# EAGLE schematic RS485 RX (EAGLE 9.6.2)
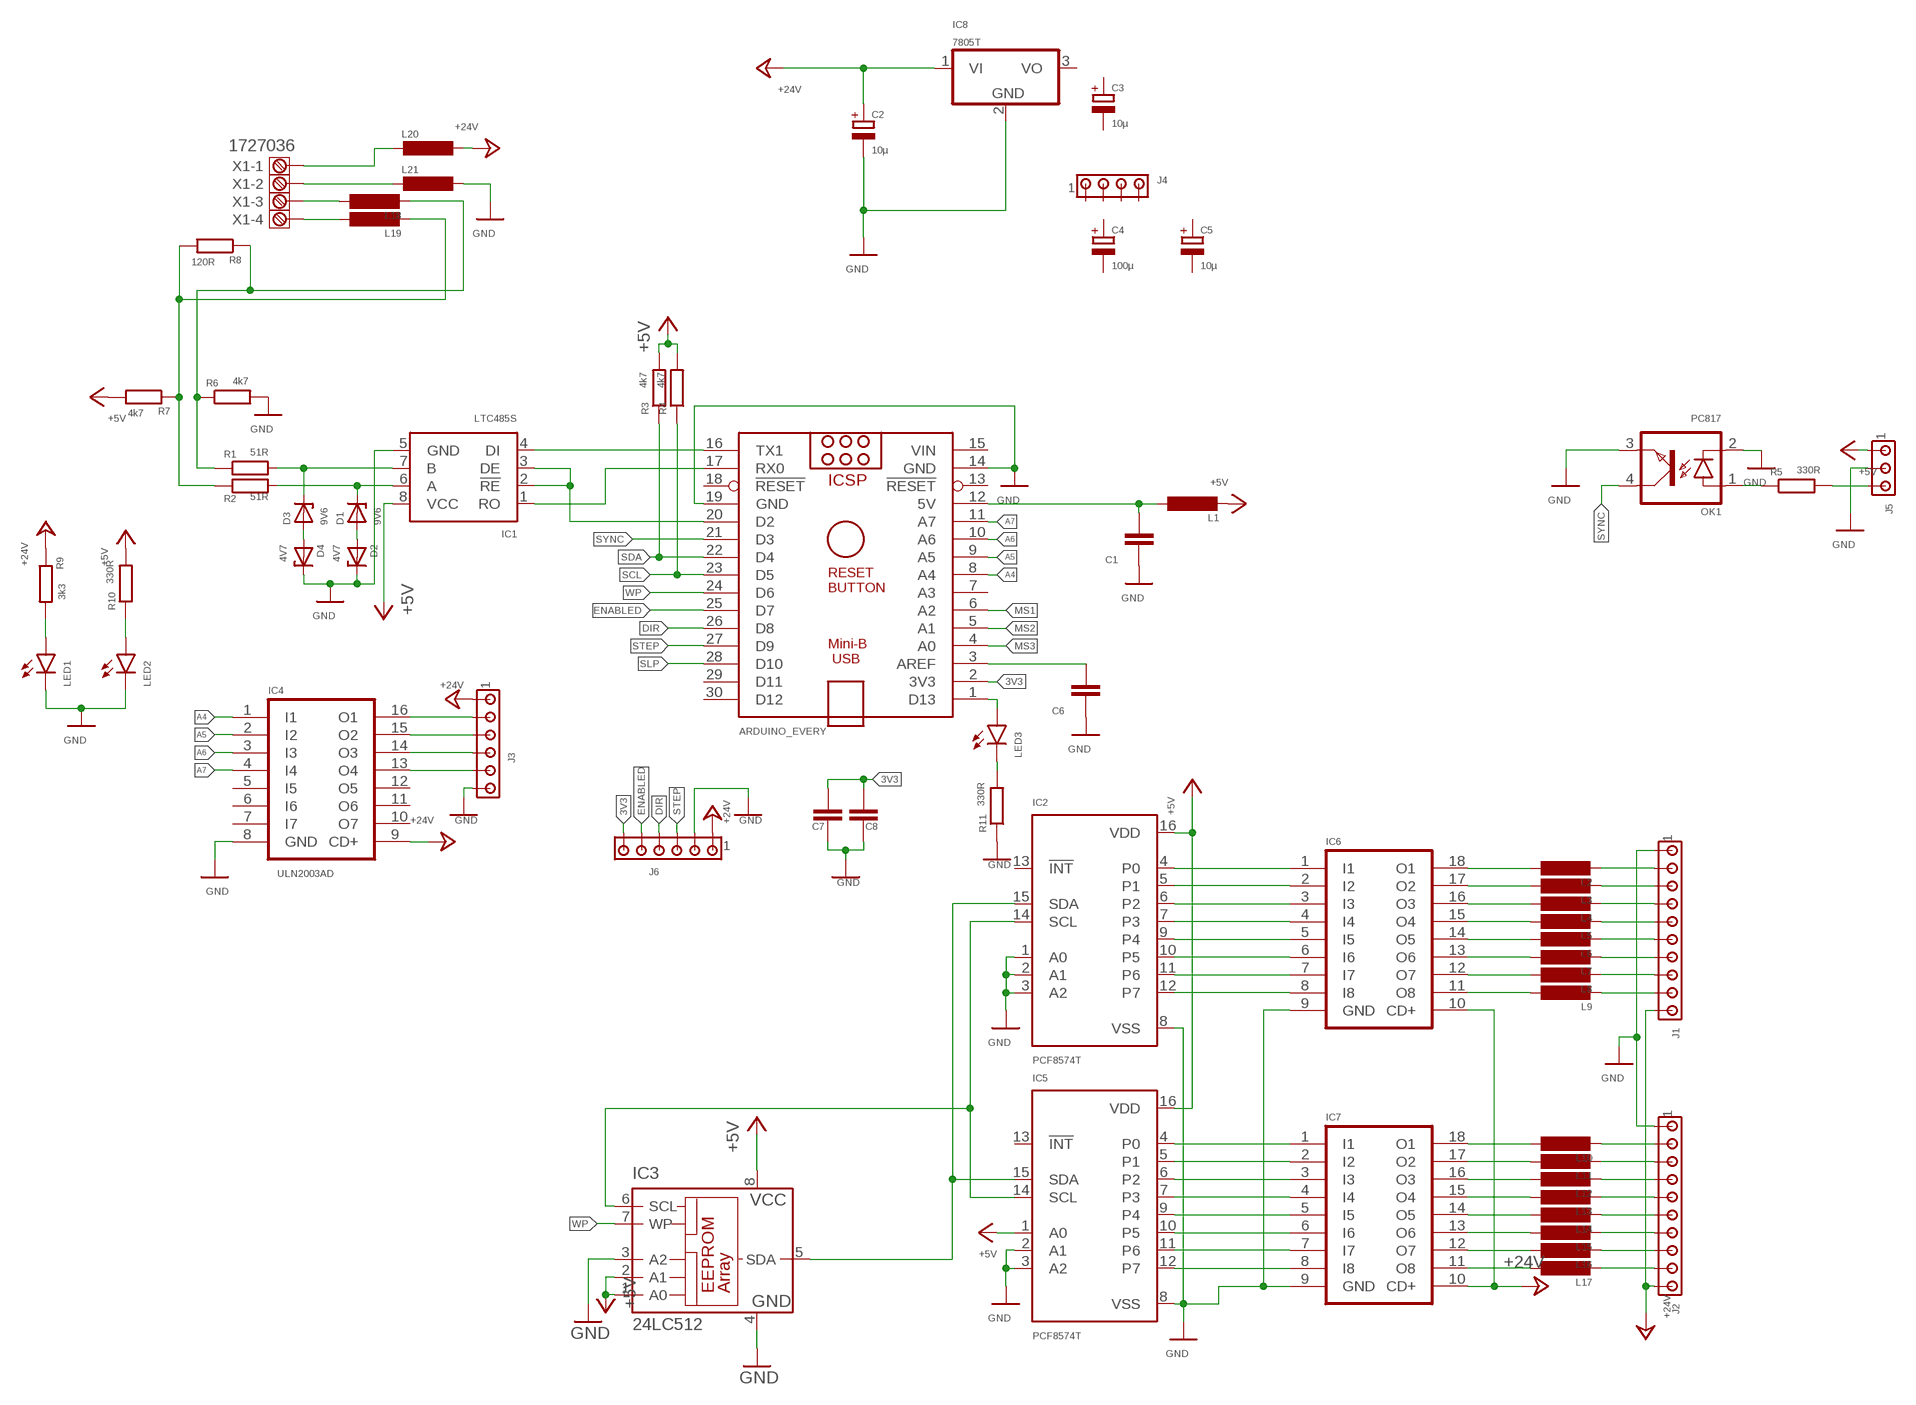
[diagram p0: schematic, sheet 1]

## Parts
ARDUINO_EVERY  ARDUINO_NANO  [ARDUINO_NANO]
C1  C-EUC0805K  [C0805K]
C2  10µ  CPOL-EU150CLZ-0810  [150CLZ-0810]
C3  10µ  CPOL-EU150CLZ-0810  [150CLZ-0810]
C4  100µ  CPOL-EU150CLZ-0810  [150CLZ-0810]
C5  10µ  CPOL-EU150CLZ-0810  [150CLZ-0810]
C6  C-EUC0805K  [C0805K]
C7  C-EUC0805K  [C0805K]
C8  C-EUC0805K  [C0805K]
D1  9V6  ZENER-DIODESOD80C  [SOD80C]
D2  4V7  ZENER-DIODESOD80C  [SOD80C]
D3  9V6  ZENER-DIODESOD80C  [SOD80C]
D4  4V7  ZENER-DIODESOD80C  [SOD80C]
IC1  LTC485S  [SOIC8]
IC2  PCF8574T  [SO16W]
IC3  24LC512  24LC128SN  [SO-08]
IC4  ULN2003AD  [SO16]
IC5  PCF8574T  [SO16W]
IC6  ULN2803A  [DIL18]
IC7  ULN2803A  [DIL18]
IC8  7805T  [TO220H]
J1  MTA10-100  [10X10MTA]
J2  MTA10-100  [10X10MTA]
J3  MTA06-100  [10X06MTA]
J4  MTA04-156  [1X4MTA]
J5  MTA03-100  [10X03MTA]
J6  MTA06-100  [10X06MTA]
L1  L-EUL1812  [L1812]
L2  L-EUL1812  [L1812]
L3  L-EUL1812  [L1812]
L4  L-EUL1812  [L1812]
L5  L-EUL1812  [L1812]
L6  L-EUL1812  [L1812]
L7  L-EUL1812  [L1812]
L8  L-EUL1812  [L1812]
L9  L-EUL1812  [L1812]
L10  L-EUL1812  [L1812]
L11  L-EUL1812  [L1812]
L12  L-EUL1812  [L1812]
L13  L-EUL1812  [L1812]
L14  L-EUL1812  [L1812]
L15  L-EUL1812  [L1812]
L16  L-EUL1812  [L1812]
L17  L-EUL1812  [L1812]
L18  L-EUL1812  [L1812]
L19  L-EUL1812  [L1812]
L20  DO3316P  [DO3316P]
L21  DO3316P  [DO3316P]
LED1  LEDCHIPLED_1206  [CHIPLED_1206]
LED2  LEDCHIPLED_1206  [CHIPLED_1206]
LED3  LEDCHIPLED_1206  [CHIPLED_1206]
OK1  PC817  [DIL04]
R1  51R  R-EU_R0805  [R0805]
R2  51R  R-EU_R0805  [R0805]
R3  4k7  R-EU_R0805  [R0805]
R4  4k7  R-EU_R0805  [R0805]
R5  330R  R-EU_R0805  [R0805]
R6  4k7  R-EU_R0805  [R0805]
R7  4k7  R-EU_R0805  [R0805]
R8  120R  R-EU_R0805  [R0805]
R9  3k3  R-EU_R0805  [R0805]
R10  330R  R-EU_R0805  [R0805]
R11  330R  R-EU_R0805  [R0805]
X1  1727036  [1727036]

## Nets
3V3: ARDUINO_EVERY.2(3V3) C7.1 C8.1 J6.6
+5V: IC1.8(VCC) IC2.16(VDD) IC3.1(A0) IC3.2(A1) IC3.8(VCC) IC5.1(A0) IC5.16(VDD) J5.1 L1.2 R3.2 R4.2 R7.2 R10.2
+24V: C2.+ IC4.9(CD+) IC6.10(CD+) IC7.10(CD+) IC8.1(VI) J1.10 J2.10 J3.1 J6.1 L20.2 R9.1
A4: ARDUINO_EVERY.8(A4) IC4.1(I1)
A5: ARDUINO_EVERY.9(A5) IC4.2(I2)
A6: ARDUINO_EVERY.10(A6) IC4.3(I3)
A7: ARDUINO_EVERY.11(A7) IC4.4(I4)
DIR: ARDUINO_EVERY.26(D8) J6.4
ENABLED: ARDUINO_EVERY.25(D7) J6.5
GND: ARDUINO_EVERY.14(GND) ARDUINO_EVERY.19(GND) C1.2 C2.- C6.2 C7.2 C8.2 D2.C D4.C IC1.5(GND) IC2.1(A0) IC2.2(A1) IC2.3(A2) IC2.8(VSS) IC3.3(A2) IC3.4(GND) IC4.8(GND) IC5.2(A1) IC5.3(A2) IC5.8(VSS) IC6.9(GND) IC7.9(GND) IC8.2(GND) J1.1 J2.1 J3.6 J5.2 J6.2 L21.2 LED1.C LED2.C OK1.2(C) OK1.3(EMIT) R6.2 R11.1
MS1: ARDUINO_EVERY.6(A2)
MS2: ARDUINO_EVERY.5(A1)
MS3: ARDUINO_EVERY.4(A0)
N$1: ARDUINO_EVERY.16(TX1) IC1.4(DI)
N$2: L18.1 X1.3
N$3: ARDUINO_EVERY.20(D2) IC1.2(!RE) IC1.3(DE)
N$4: D3.A D4.A
N$5: D1.A D2.A
N$6: D1.C IC1.6(A) R2.2
N$7: D3.C IC1.7(B) R1.2
N$8: ARDUINO_EVERY.1(D13) LED3.A
N$9: IC2.4(P0) IC6.1(I1)
N$10: IC2.5(P1) IC6.2(I2)
N$11: IC2.6(P2) IC6.3(I3)
N$12: IC4.16(O1) J3.2
N$13: IC2.7(P3) IC6.4(I4)
N$14: L19.1 X1.4
N$15: L20.1 X1.1
N$16: L21.1 X1.2
N$17: IC4.15(O2) J3.3
N$18: IC5.4(P0) IC7.1(I1)
N$19: IC5.5(P1) IC7.2(I2)
N$20: IC5.6(P2) IC7.3(I3)
N$21: IC5.7(P3) IC7.4(I4)
N$22: IC5.9(P4) IC7.5(I5)
N$23: IC5.10(P5) IC7.6(I6)
N$24: IC5.11(P6) IC7.7(I7)
N$25: IC5.12(P7) IC7.8(I8)
N$26: IC6.18(O1) L2.1
N$27: IC6.17(O2) L3.1
N$28: IC6.16(O3) L4.1
N$29: IC6.15(O4) L5.1
N$30: IC6.14(O5) L6.1
N$31: IC6.13(O6) L7.1
N$32: IC6.12(O7) L8.1
N$33: IC6.11(O8) L9.1
N$34: IC7.18(O1) L10.1
N$35: IC7.17(O2) L11.1
N$36: IC7.16(O3) L12.1
N$37: IC7.15(O4) L13.1
N$38: IC7.14(O5) L14.1
N$39: IC7.13(O6) L15.1
N$40: IC7.12(O7) L16.1
N$41: IC7.11(O8) L17.1
N$42: J1.2 L2.2
N$43: J1.3 L3.2
N$44: J1.4 L4.2
N$45: J1.5 L5.2
N$46: J1.6 L6.2
N$47: J1.7 L7.2
N$48: J1.8 L8.2
N$49: J1.9 L9.2
N$50: J2.2 L10.2
N$51: J2.3 L11.2
N$52: ARDUINO_EVERY.17(RX0) IC1.1(RO)
N$53: J2.5 L13.2
N$54: J2.6 L14.2
N$55: J2.7 L15.2
N$56: J2.8 L16.2
N$57: J2.9 L17.2
N$58: J2.4 L12.2
N$59: OK1.1(A) R5.1
N$60: IC2.12(P7) IC6.8(I8)
N$61: IC2.11(P6) IC6.7(I7)
N$62: IC2.10(P5) IC6.6(I6)
N$63: IC2.9(P4) IC6.5(I5)
N$64: J5.3 R5.2
N$65: IC4.14(O3) J3.4
N$66: ARDUINO_EVERY.3(AREF) C6.1
N$67: IC4.13(O4) J3.5
N$68: L18.2 R1.1 R6.1 R8.1
N$69: L19.2 R2.1 R7.1 R8.2
N$70: LED3.C R11.2
N$78: ARDUINO_EVERY.12(5V) C1.1 L1.1
N$80: LED1.A R9.2
N$81: LED2.A R10.1
SCL: ARDUINO_EVERY.23(D5) IC2.14(SCL) IC3.6(SCL) IC5.14(SCL) R4.1
SDA: ARDUINO_EVERY.22(D4) IC2.15(SDA) IC3.5(SDA) IC5.15(SDA) R3.1
SLP: ARDUINO_EVERY.28(D10)
STEP: ARDUINO_EVERY.27(D9) J6.3
SYNC: ARDUINO_EVERY.21(D3) OK1.4(COL)
WP: ARDUINO_EVERY.24(D6) IC3.7(WP)
Unconnected: ARDUINO_EVERY.7(A3) ARDUINO_EVERY.13(!RESET) ARDUINO_EVERY.18(!RESET) ARDUINO_EVERY.29(D11) ARDUINO_EVERY.30(D12) C3.+ C3.- C4.+ C4.- C5.+ C5.- IC2.13(!INT) IC4.5(I5) IC4.6(I6) IC4.7(I7) IC4.10(O7) IC4.11(O6) IC4.12(O5) IC5.13(!INT) IC8.3(VO) J4.1 J4.2 J4.3 J4.4

## Power pins joined to a net without a drawn wire
VIN: ARDUINO_EVERY.15(VIN)

## Library data of the parts
ARDUINO_EVERY = ArduinoNanoV30:ARDUINO_NANO: Arduino Nano V3.0 Overview: The Arduino Nano is a small, complete, and breadboard-friendly board based on the ATmega328 (Arduino Nano 3.x) or ATmega168 (Arduino Nano 2.x). It has more or less the same functionality of the Arduino Duemilanove, but in a different package. It lacks only a DC power jack, and works with a Mini-B USB cable instead of a standard one. The Nano was designed and is being produced by Gravitech. Specifications: Microcontroller Atmel ATmega168 or ATmega328 Operating Voltage (logic level) 5 V Input Voltage (recommended) 7-12 V Input Voltage (limits) 6-20 V Digital I/O Pins 14 (of which 6 provide PWM output) Analog Input Pins 8 DC Current per I/O Pin 40 mA Flash Memory 16 KB (ATmega168) or 32 KB (ATmega328) of which 2 KB used by bootloader SRAM 1 KB (ATmega168) or 2 KB (ATmega328) EEPROM 512 bytes (ATmega168) or 1 KB (ATmega328) Clock Speed 16 MHz Dimensions 0.73" x 1.70" Length 45 mm Width 18 mm Weigth 5 g Power: The Arduino Nano can be powered via the Mini-B USB connection, 6-20V unregulated external power supply (pin 30), or 5V regulated external power supply (pin 27). The power source is automatically selected to the highest voltage source. Memory: The ATmega168 has 16 KB of flash memory for storing code (of which 2 KB is used for the bootloader); the ATmega328 has 32 KB, (also with 2 KB used for the bootloader). The ATmega168 has 1 KB of SRAM and 512 bytes of EEPROM (which can be read and written with the EEPROM library); the ATmega328 has 2 KB of SRAM and 1 KB of EEPROM. Input and Output: Each of the 14 digital pins on the Nano can be used as an input or output, using pinMode(), digitalWrite(), and digitalRead() functions. They operate at 5 volts. Each pin can provide or receive a maximum of 40 mA and has an internal pull-up resistor (disconnected by default) of 20-50 kOhms. In addition, some pins have specialized functions. Visit Arduino - ArduinoBoardNano <https://www.arduino.cc/en/Main/ArduinoBoardNano>
C1 C6-C8 = rcl:C-EU: CAPACITOR, European symbol; SPICEPREFIX: C
C2-C5 = rcl:CPOL-EU: POLARIZED CAPACITOR, European symbol; SPICEPREFIX: C
D1-D4 = diode:ZENER-DIODE: Z-Diode
IC1 = 104-5:LTC485: Low Power RS485 Interface Transceiver Source: http://www.linear.com/pc/downloadDocument.do?navId=H0,C1,C1007,C1017,P2064,D1718
IC2 IC5 = micro-philips:PCF8574: I2C-Bus Remote 8-bit I/O expander http://www.semiconductors.philips.com/acrobat_download/datasheets/PCF8574_4.pdf; MPN: PCF8574T/3,512; OC_FARNELL: 1201255; OC_NEWARK: 70R6870
IC3 = microchip:24*: Serial EEPROM I2C; MF: MICROCHIP; MPN: 24LC128-I/SNG; OC_FARNELL: 9757937; OC_NEWARK: 30H1511
IC4 = uln-udn:ULN2003A: DRIVER ARRAY
IC6 IC7 = uln-udn:ULN2803A: DRIVER ARRAY
IC8 = linear:78*: Positive VOLTAGE REGULATOR Source: http://cache.national.com/ds/LM/LM78L05.pdf http://www.fairchildsemi.com/ds/LM/LM7805.pdf
J1 J2 = con-amp:MTA10-100: AMP connector
J3 J6 = con-amp:MTA06-100: AMP connector Connection corrected 2014-09-19
J4 = con-amp:MTA04-156: AMP connector
J5 = con-amp:MTA03-100: AMP connector
L1-L19 = rcl:L-EU: INDUCTOR, European symbol; SPICEPREFIX: L
L20 L21 = inductor-coilcraft:DO3316P: COILCRAFT; OC_FARNELL: unknown; OC_NEWARK: unknown
LED1-LED3 = led:LED: LED OSRAM: - CHIPLED LG R971, LG N971, LY N971, LG Q971, LY Q971, LO R971, LY R971 LH N974, LH R974 LS Q976, LO Q976, LY Q976 LO Q996 - Hyper CHIPLED LW Q18S LB Q993, LB Q99A, LB R99A - SideLED LS A670, LO A670, LY A670, LG A670, LP A670 LB A673, LV A673, LT A673, LW A673 LH A674 LY A675 LS A676, LA A676, LO A676, LY A676, LW A676 LS A679, LY A679, LG A679 - Hyper Micro SIDELED® LS Y876, LA Y876, LO Y876, LY Y876 LT Y87S - SmartLED LW L88C, LW L88S LB L89C, LB L89S, LG L890 LS L89K, LO L89K, LY L89K LS L896, LA L896, LO L896, LY L896 - TOPLED LS T670, LO T670, LY T670, LG T670, LP T670 LSG T670, LSP T670, LSY T670, LOP T670, LYG T670 LG T671, LOG T671, LSG T671 LB T673, LV T673, LT T673, LW T673 LH T674 LS T676, LA T676, LO T676, LY T676, LB T676, LH T676, LSB T676, LW T676 LB T67C, LV T67C, LT T67C, LS T67K, LO T67K, LY T67K, LW E67C LS E67B, LA E67B, LO E67B, LY E67B, LB E67C, LV E67C, LT E67C LW T67C LS T679, LY T679, LG T679 LS T770, LO T770, LY T770, LG T770, LP T770 LB T773, LV T773, LT T773, LW T773 LH T774 LS E675, LA E675, LY E675, LS T675 LS T776, LA T776, LO T776, LY T776, LB T776 LHGB T686 LT T68C, LB T68C - Hyper Mini TOPLED® LB M676 - Mini TOPLED Santana® LG M470 LS M47K, LO M47K, LY M47K Source: http://www.osram.convergy.de LUXEON: - LUMILED® LXK2-PW12-R00, LXK2-PW12-S00, LXK2-PW14-U00, LXK2-PW14-V00 LXK2-PM12-R00, LXK2-PM12-S00, LXK2-PM14-U00 LXK2-PE12-Q00, LXK2-PE12-R00, LXK2-PE12-S00, LXK2-PE14-T00, LXK2-PE14-U00 LXK2-PB12-K00, LXK2-PB12-L00, LXK2-PB12-M00, LXK2-PB14-N00, LXK2-PB14-P00, LXK2-PB14-Q00 LXK2-PR12-L00, LXK2-PR12-M00, LXK2-PR14-Q00, LXK2-PR14-R00 LXK2-PD12-Q00, LXK2-PD12-R00, LXK2-PD12-S00 LXK2-PH12-R00, LXK2-PH12-S00 LXK2-PL12-P00, LXK2-PL12-Q00, LXK2-PL12-R00 Source: www.luxeon.com KINGBRIGHT: KA-3528ASYC Source: www.kingbright.com
OK1 = optocoupler:PC817: SHARP OPTO COUPLER; MPN: PC817X4J000F; OC_FARNELL: 9707727; OC_NEWARK: 97K7059
R1-R11 = rcl:R-EU_: RESISTOR, European symbol; SPICEPREFIX: R
X1 = con-phoenix-3.81:1727036: MKDS 1/4-3,81 Source: http://eshop.phoenixcontact.de; MF: FARNELL; MPN: 1727036; OC_FARNELL: 3704592; OC_NEWARK: 71C4114